# Altium schematic sheet MicroController.SchDoc: SealHAT - SAML21 Microcontroller
size Letter; DocumentNumber: 2; SheetNumber: 2; SheetTotal: 6; PageSetup: Record=PageOptions|CenterHorizontal=True|CenterVertical=True|PrintScale=0.94|XCorrection=1.00|YCorrection=1.00|PrintKind=1|BorderSize=5000000|LeftOffset=0|BottomOffset=0|Orientation=2|PaperLength=1000|PaperWidth=1000|Scale=100|PaperSource=7|PrintQuality=-3|MediaType=1|DitherType=10|PrintScaleMode=1|PaperKind=Letter|PaperIndex=1
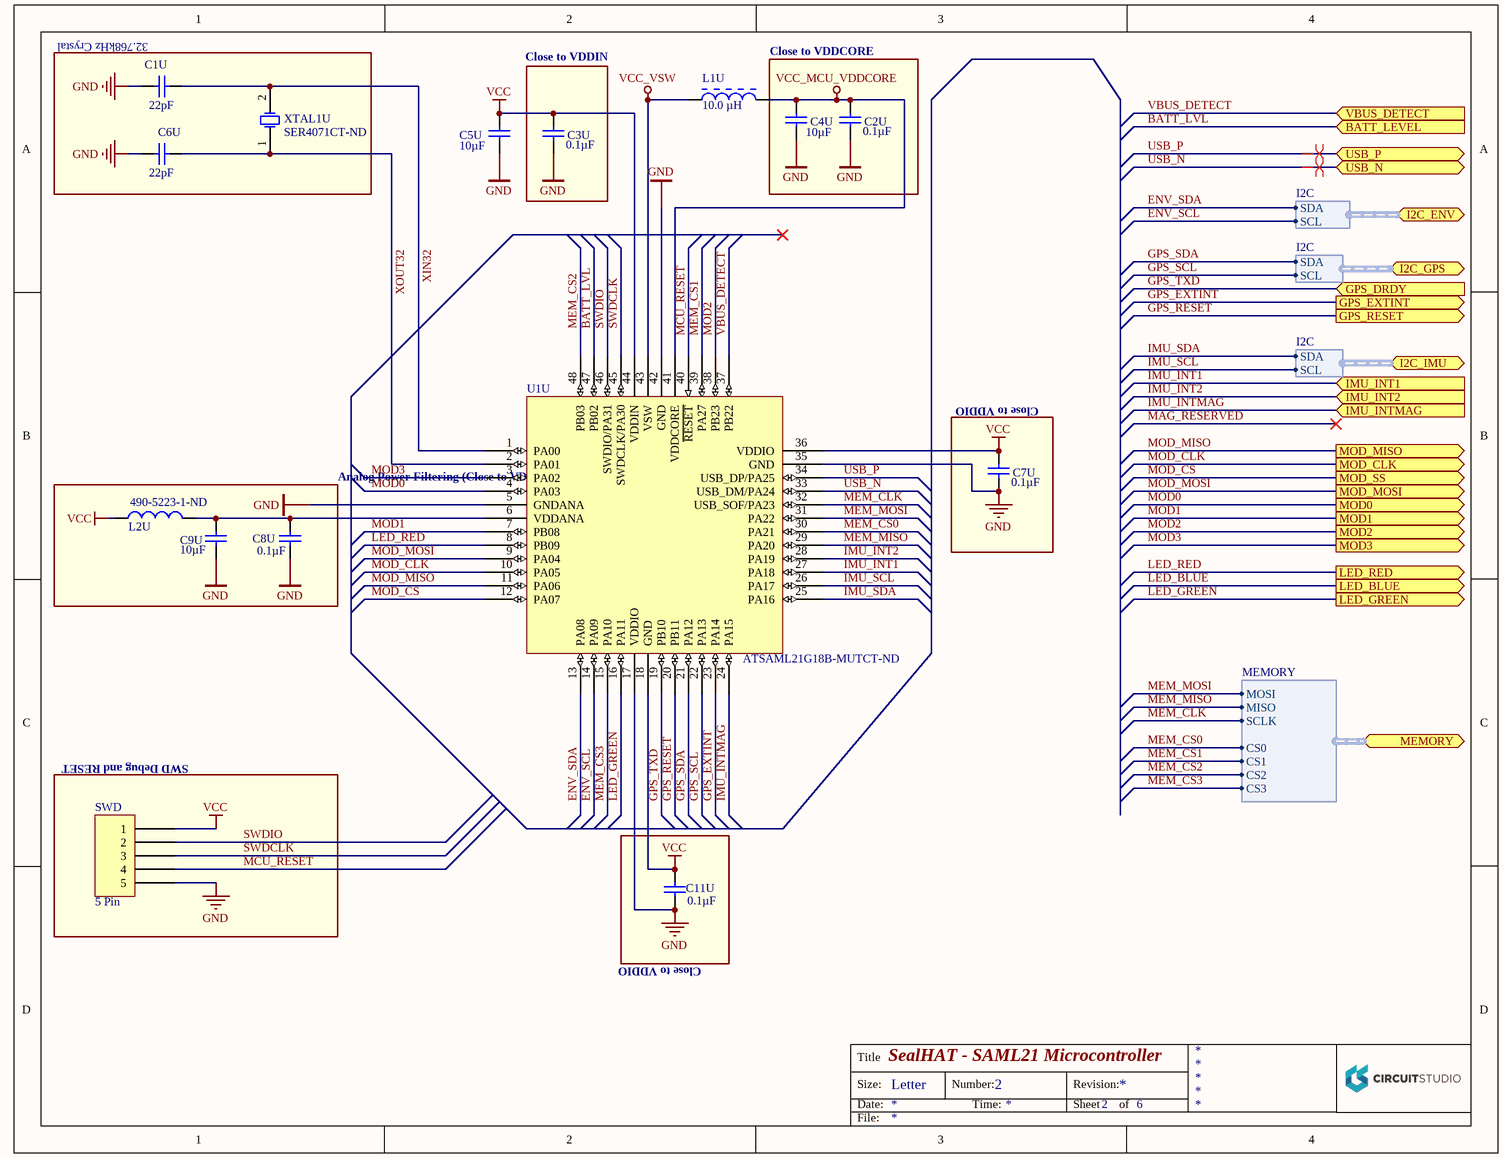
[diagram p0: MicroController.SchDoc]

## Parts
C1U  Capacitance: 22pF  [C0402M]  (hidden comment: GRM1555C1H220FA01D)
C2U  Capacitance: 0.1µF  [C0603N]  (hidden comment: GCM188R71C104KA37D)
C3U  Capacitance: 0.1µF  [C0603N]  (hidden comment: GCM188R71C104KA37D)
C4U  Capacitance: 10µF  [C0603N]  (hidden comment: GRT188R61C106KE13D)
C5U  Capacitance: 10µF  [C0603N]  (hidden comment: GRT188R61C106KE13D)
C6U  Capacitance: 22pF  [C0402M]  (hidden comment: GRM1555C1H220FA01D)
C7U  Capacitance: 0.1µF  [C0603N]  (hidden comment: GCM188R71C104KA37D)
C8U  Capacitance: 0.1µF  [C0603N]  (hidden comment: GCM188R71C104KA37D)
C9U  Capacitance: 10µF  [C0603N]  (hidden comment: GRT188R61C106KE13D)
C11U  Capacitance: 0.1µF  [C0603N]  (hidden comment: GCM188R71C104KA37D)
L1U  Inductance: 10.0 µH  [SRN3015]  (hidden comment: SRN3015-100M)
L2U  Supplier Part Number 1: 490-5223-1-ND  [R0603N]  (hidden comment: BLM18PG471SN1D)
SWD  5 Pin  [Pinhead254_90_1x5]
U1U  Supplier Part Number 1: ATSAML21G18B-MUTCT-ND  [TQFP48_7X7_P50]  (hidden comment: ATSAML21G18B-MUT)
XTAL1U  Supplier Part Number 1: SER4071CT-ND  [FC-135R$2F$FC-135]  (hidden comment: FC-135 32.7680KA-A3)

## Blocks framed on the sheet
32.768kHz Crystal: C1U C6U XTAL1U
Close to VDDIN: C3U
Close to VDDCORE: C2U C4U
Close to VDDIO: C7U
Analog Power Filtering (Close to VDDANA/GNDANA): C8U C9U L2U
SWD Debug and RESET: SWD
Close to VDDIO: C11U

## Ports
BATT_LEVEL (in), GPS_DRDY (in), GPS_EXTINT (out), GPS_RESET (out), I2C_ENV (harness I2C), I2C_GPS (harness I2C), I2C_IMU (harness I2C), IMU_INT1 (in), IMU_INT2 (in), IMU_INTMAG (in), LED_BLUE (out), LED_GREEN (out), LED_RED (out), MEMORY (harness MEMORY), MOD0 (out), MOD1 (out), MOD2 (out), MOD3 (out), MOD_CLK (out), MOD_MISO (out), MOD_MOSI (out), MOD_SS (out), USB_N (bidir), USB_P (bidir), VBUS_DETECT (in)

## Harnesses
I2C: SDA, SCL
I2C: SCL, SDA
MEMORY: MOSI, MISO, SCLK, CS0, CS1, CS2, CS3

## Nets
GND: C1U.2 C2U.1 C3U.1 C4U.1 C5U.1 C6U.2 C7U.1 C8U.2 C9U.1 C11U.2 SWD.5 U1U.5(GNDANA) U1U.17(VDDIO) U1U.35(GND) U1U.42(GND)
VCC: C3U.2 C5U.2 C7U.2 C11U.1 L2U.1 SWD.1 U1U.18(GND) U1U.36(VDDIO) U1U.44(VDDIN)
VCC_MCU_VDDCORE: C2U.2 C4U.2 L1U.2 U1U.41(VDDCORE)
VCC_VSW: L1U.1 U1U.43(VSW)
BATT_LVL: U1U.47(PB02) ; port BATT_LEVEL
ENV_SCL: U1U.14(PA09) ; port I2C_ENV.SCL
ENV_SDA: U1U.13(PA08) ; port I2C_ENV.SDA
GPS_EXTINT: U1U.23(PA14) ; port GPS_EXTINT
GPS_RESET: U1U.20(PB11) ; port GPS_RESET
GPS_SCL: U1U.22(PA13) ; port I2C_GPS.SCL
GPS_SDA: U1U.21(PA12) ; port I2C_GPS.SDA
GPS_TXD: U1U.19(PB10) ; port GPS_DRDY
IMU_INT1: U1U.27(PA18) ; port IMU_INT1
IMU_INT2: U1U.28(PA19) ; port IMU_INT2
IMU_INTMAG: U1U.24(PA15) ; port IMU_INTMAG
IMU_SCL: U1U.26(PA17) ; port I2C_IMU.SCL
IMU_SDA: U1U.25(PA16) ; port I2C_IMU.SDA
LED_BLUE: port LED_BLUE
LED_GREEN: U1U.16(PA11) ; port LED_GREEN
LED_RED: U1U.8(PB09) ; port LED_RED
MCU_RESET: SWD.4 U1U.40(~{RESET})
MEM_CLK: U1U.32(USB_SOF/PA23) ; port MEMORY.SCLK
MEM_CS0: U1U.30(PA21) ; port MEMORY.CS0
MEM_CS1: U1U.39(PA27) ; port MEMORY.CS1
MEM_CS2: U1U.48(PB03) ; port MEMORY.CS2
MEM_CS3: U1U.15(PA10) ; port MEMORY.CS3
MEM_MISO: U1U.29(PA20) ; port MEMORY.MISO
MEM_MOSI: U1U.31(PA22) ; port MEMORY.MOSI
MOD0: U1U.4(PA03) ; port MOD0
MOD1: U1U.7(PB08) ; port MOD1
MOD2: U1U.38(PB23) ; port MOD2
MOD3: U1U.3(PA02) ; port MOD3
MOD_CLK: U1U.10(PA05) ; port MOD_CLK
MOD_CS: U1U.12(PA07) ; port MOD_SS
MOD_MISO: U1U.11(PA06) ; port MOD_MISO
MOD_MOSI: U1U.9(PA04) ; port MOD_MOSI
SWDCLK: SWD.3 U1U.45(SWDCLK/PA30)
SWDIO: SWD.2 U1U.46(SWDIO/PA31)
USB_N: U1U.33(USB_DM/PA24) ; port USB_N
USB_P: U1U.34(USB_DP/PA25) ; port USB_P
VBUS_DETECT: U1U.37(PB22) ; port VBUS_DETECT
XIN32: C1U.1 U1U.1(PA00) XTAL1U.2(X2)
XOUT32: C6U.1 U1U.2(PA01) XTAL1U.1(X1)
NetC8U_1: C8U.1 C9U.2 L2U.2 U1U.6(VDDANA)

## Layout directives
differential pair: USB_N, USB_P

## Notes on the sheet
- Title
- Size:
- Date:
- Letter
- Number:
- Time:
- Revision:
- Sheet
- of
- File:

## Library data of the parts
C1U C6U = CAPACITOR_NP: CAP CER 22PF 50V C0G/NP0 0402; HOUSEPART: NO; POPULATE: 1; TOLERANCE: ±1%; Temperature Coefficient: X5R; DeviceName: GRM1555C1H220FA01D; LibraryName: MF_Passives; DeviceSetName: CAPACITOR_NP; MPN: GRM1555C1H220FA01D; URL: https://octopart.com/grm1555c1h220fa01d-murata-21524193; VOLTAGE: 50V; MF_PARTNUM: GRM1555C1H220FA01D; Supplier 1: Digi-Key; Supplier Part Number 1: 490-8589-1-ND
C2U C3U C7U C8U C11U = CAPACITOR_NP: HOUSEPART: NO; POPULATE: 1; TOLERANCE: ±10%; VOLTAGE: 16V; Temperature Coefficient: X7R; DeviceName: GCM188R71C104KA37D; LibraryName: MF_Passives; DeviceSetName: CAPACITOR_NP; MPN: GCM188R71C104KA37D; MF_PARTNUM: GCM188R71C104KA37D; Supplier 1: Digi-Key; Supplier Part Number 1: 490-4774-1-ND
C4U C5U C9U = CAPACITOR_NP: 10µF 16V Ceramic Capacitor X5R 0603; HOUSEPART: NO; POPULATE: 1; TOLERANCE: ±10%; VOLTAGE: 10V; DeviceName: GRT188R61C106KE13D; LibraryName: MF_Passives; DeviceSetName: CAPACITOR_NP; MPN: GRT188R61C106KE13D; MF_PARTNUM: GRT188R61C106KE13D; Supplier 1: Digi-Key; Supplier Part Number 1: 490-12317-1-ND
L1U = CMP-911278-2: Semi-shielded Power Inductor, 10 uH, +/- 20%, 1 A, -40 to 125 degC, 3 x 3 x 1.5 mm SMD, RoHS and Halogen Free, Tape and Reel; Self Resonant Frequency: 45000000.0 Hz; Number of Pins: 2; Octopart Url: https://octopart.com/srn3015-100m-bourns-20579191; OctopartID: 45668d5663779aa1; Packaging: Tape & Reel (TR); REACH SVHC Compliance: No SVHC; RoHS: Compliant; Manufacturer Part Number: SRN3015-100M; Supplier 1: Digi-Key; Supplier Part Number 1: SRN3015TA-100MCT-ND
L2U = INDUCTOR: FERRITE BEAD 470 OHM 0603 1LN; HOUSEPART: NO; MPN: LI0603G221R-10; POPULATE: 1; LibraryName: MF_Passives; DeviceSetName: INDUCTOR; Supplier 1: Digi-Key
U1U = ATSAML21G18B-MUT: RAM Memory Size: 32768 B; Octopart URL: https://octopart.com/atsaml21g18b-mut-microchip-77761695; RoHS: Compliant; OctopartID: 3cd3f17b952ae314; Manufacturer Part Number: ATSAML21G18B-MUT; Supplier 1: Digi-Key
XTAL1U = FC-13532.7680KA-A3: FC-135 Series 32.768 KHz ±20 ppm 12.5 pF -40 to +85°C Surface Mount Crystal; manufacturer: epson; Octopart URL: https://octopart.com/fc-135+32.7680ka-a3-epson-39545807; Manufacturer Part Number: FC-135 32.7680KA-A3; Case/Package: FC-135; Supplier 1: Digi-Key